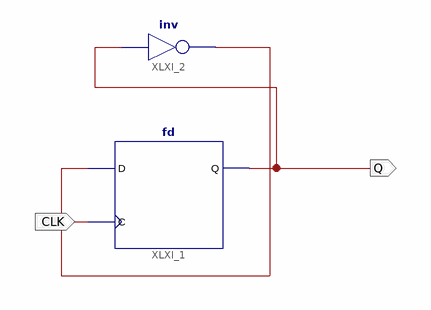
[diagram p0: schematic sheet 1]
// Xilinx ISE schematic CLK_div2.sch (spartan6) as structural Verilog: 2 symbols, 2 ports
module CLK_div2 (
  input  CLK,
  output Q
);

  wire XLXN_2;

  fd XLXI_1 (.C(CLK), .D(XLXN_2), .Q(Q));
  not XLXI_2 (XLXN_2, Q);
endmodule
